# EAGLE design RF24 Node (EAGLE 6.5.0)
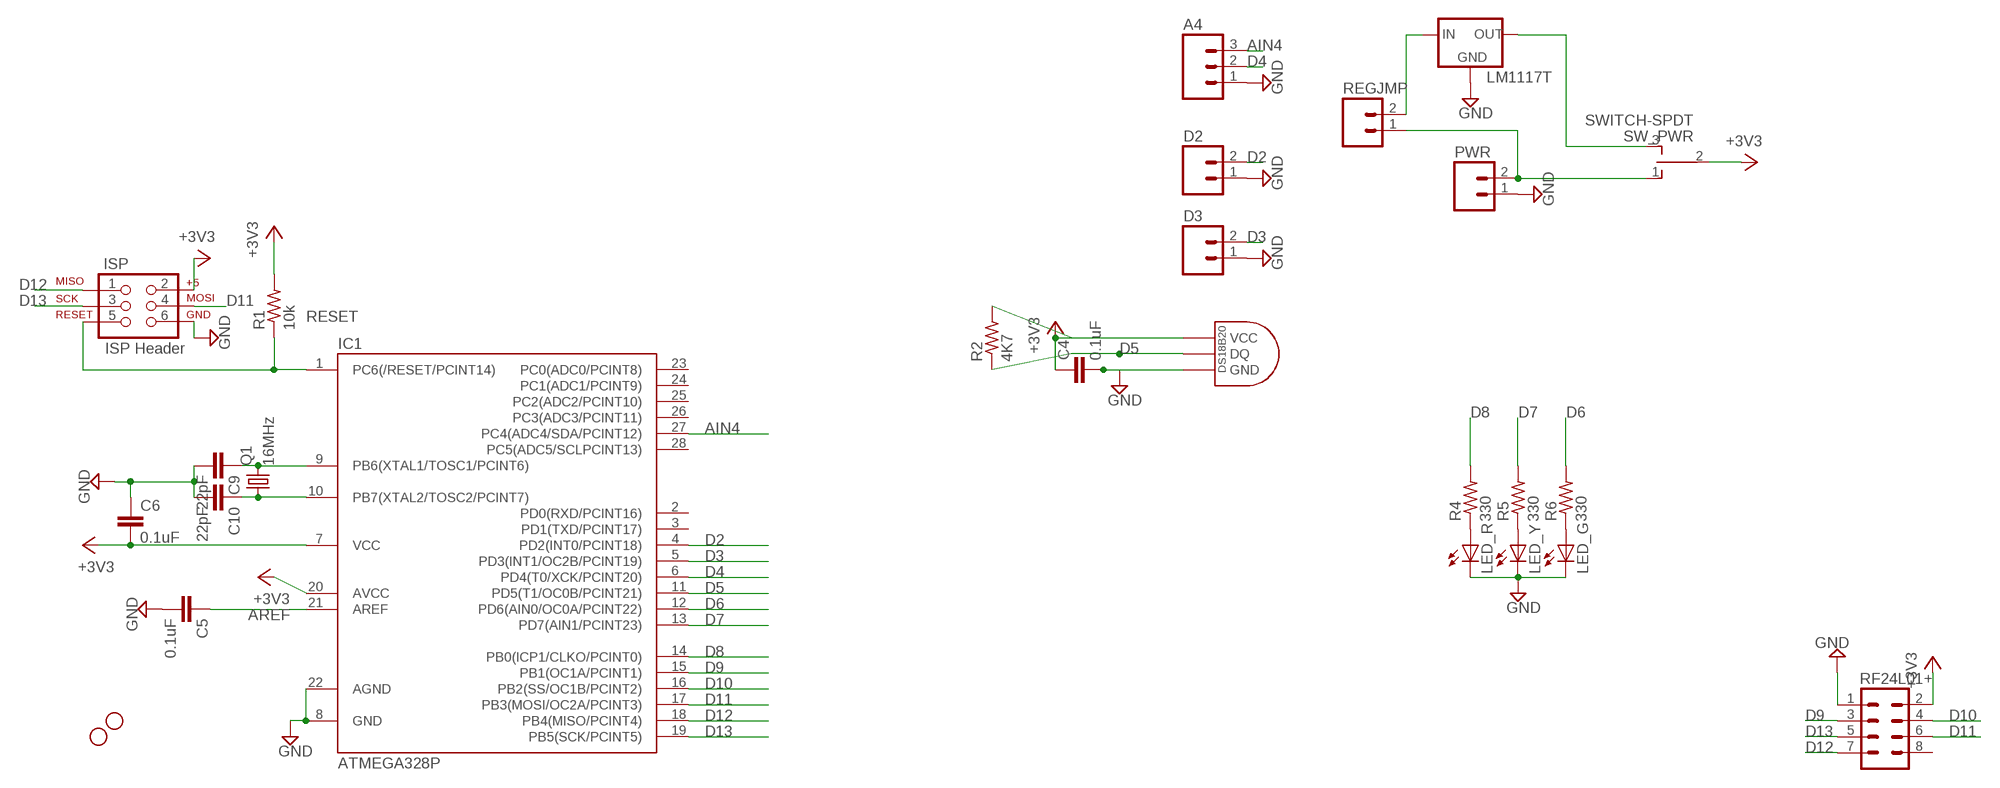
[diagram p0: schematic, sheet 1]

## Parts
A4  M03PTH  [1X03]
C4  0.1uF  C-EU025-025X050  [C025-025X050]
C5  0.1uF  C-EU025-025X050  [C025-025X050]
C6  0.1uF  C-EU025-025X050  [C025-025X050]
C9  22pF  C-EU025-025X050  [C025-025X050]
C10  22pF  C-EU025-025X050  [C025-025X050]
D2  M02PTH  [1X02]
D3  M02PTH  [1X02]
DS18B20  DS1820TO92  [DS1820]
IC1  ATMEGA328P  ATMEGA48/88/168-PU  [DIL28-3]
ISP  ISP Header  AVR_SPI_PRG_6PTH  [2X3]
JP2  STAND-OFF  [STAND-OFF]
JP8  STAND-OFF  [STAND-OFF]
LED_G  LED3MM  [LED3MM]
LED_R  LED3MM  [LED3MM]
LED_Y  LED3MM  [LED3MM]
LM1117T  LM1117T-3.3-V  [TO220V]
PWR  M02PTH  [1X02]
Q1  16MHz  CRYSTALHC49S  [HC49/S]
R1  10k  R-US_0204/2V  [0204V]
R2  4K7  R-US_0204/2V  [0204V]
R4  330  R-US_0204/2V  [0204V]
R5  330  R-US_0204/2V  [0204V]
R6  330  R-US_0204/2V  [0204V]
REGJMP  M02PTH  [1X02]
RF24L01+  M04X2  [2X4]
SW_PWR  SWITCH-SPDT  [OS102011MS2QN1]

## Nets
+3V3: C4.1 C6.2 DS18B20.VDD(VCC) IC1.7(VCC) IC1.20(AVCC) ISP.2 R1.2 R2.2 RF24L01+.2 SW_PWR.2(P)
AIN4: A4.3 IC1.27(PC4(ADC4/SDA/PCINT12))
AREF: C5.1 IC1.21(AREF)
D2: D2.2 IC1.4(PD2(INT0/PCINT18))
D3: D3.2 IC1.5(PD3(INT1/OC2B/PCINT19))
D4: A4.2 IC1.6(PD4(T0/XCK/PCINT20))
D5: DS18B20.DQ IC1.11(PD5(T1/OC0B/PCINT21)) R2.1
D6: IC1.12(PD6(AIN0/OC0A/PCINT22)) R6.2
D7: IC1.13(PD7(AIN1/PCINT23)) R5.2
D8: IC1.14(PB0(ICP1/CLKO/PCINT0)) R4.2
D9: IC1.15(PB1(OC1A/PCINT1)) RF24L01+.3
D10: IC1.16(PB2(SS/OC1B/PCINT2)) RF24L01+.4
D11: IC1.17(PB3(MOSI/OC2A/PCINT3)) ISP.4 RF24L01+.6
D12: IC1.18(PB4(MISO/PCINT4)) ISP.1 RF24L01+.7
D13: IC1.19(PB5(SCK/PCINT5)) ISP.3 RF24L01+.5
EXTPWR: PWR.2 REGJMP.1 SW_PWR.1(O)
GND: A4.1 C4.2 C5.2 C6.1 C9.2 C10.2 D2.1 D3.1 DS18B20.GND IC1.8(GND) IC1.22(AGND) ISP.6 LED_G.K(C) LED_R.K(C) LED_Y.K(C) LM1117T.1(GND) PWR.1 RF24L01+.1
N$1: LM1117T.2(OUT) SW_PWR.3(S)
N$2: LED_R.A R4.1
N$3: LED_Y.A R5.1
N$4: LED_G.A R6.1
N$5: LM1117T.3(IN) REGJMP.2
RESET: IC1.1(PC6(/RESET/PCINT14)) ISP.5 R1.1
XTAL1: C9.1 IC1.9(PB6(XTAL1/TOSC1/PCINT6)) Q1.2
XTAL2: C10.1 IC1.10(PB7(XTAL2/TOSC2/PCINT7)) Q1.1
Unconnected: IC1.2(PD0(RXD/PCINT16)) IC1.3(PD1(TXD/PCINT17)) IC1.23(PC0(ADC0/PCINT8)) IC1.24(PC1(ADC1/PCINT9)) IC1.25(PC2(ADC2/PCINT10)) IC1.26(PC3(ADC3/PCINT11)) IC1.28(PC5(ADC5/SCLPCINT13)) RF24L01+.8

## Library data of the parts
A4 = SparkFun-Connectors:M03: Header 3 Standard 3-pin 0.1" header. Use with straight break away headers (SKU : PRT-00116), right angle break away headers (PRT-00553), swiss pins (PRT-00743), machine pins (PRT-00117), and female headers (PRT-00115). Molex polarized connector foot print use with SKU : PRT-08232 with associated crimp pins and housings.
C4-C6 C9 C10 = resistor:C-EU: CAPACITOR, European symbol
D2 D3 PWR REGJMP = SparkFun-Connectors:M02: Standard 2-pin 0.1" header. Use with - straight break away headers ( PRT-00116) - right angle break away headers (PRT-00553) - swiss pins (PRT-00743) - machine pins (PRT-00117) - female headers (PRT-00115) Molex polarized connector foot print use with: PRT-08233 with associated crimp pins and housings. 2.54_SCREWTERM for use with PRT-10571. 3.5mm Screw Terminal footprints for PRT-08084 5mm Screw Terminal footprints for use with PRT-08433
DS18B20 = Ava:DS1820: DS18B20 Programmable Resolution 1-Wire Digital Thermometer Description The DS18B20 digital thermometer provides 9-bit to 12-bit Celsius temperature measurements and has an alarm function with nonvolatile user-programmable upper and lower trigger points. The DS18B20 communicates over a 1-Wire® bus that by definition requires only one data line (and ground) for communication with a central microprocessor. It has an operating temperature range of -55°C to +125°C and is accurate to ±0.5°C over the range of -10°C to +85°C. In addition, the DS18B20 can derive power directly from the data line ("parasite power"), eliminating the need for an external power supply. Each DS18B20 has a unique 64-bit serial code, which allows multiple DS18B20s to function on the same 1-Wire bus. Thus, it is simple to use one microprocessor to control many DS18B20s distributed over a large area. Applications that can benefit from this feature include HVAC environmental controls, temperature monitoring systems inside buildings, equipment, or machinery, and process monitoring and control systems.
IC1 = atmega8:ATMEGA48/88/168-PU
ISP = SparkFun-Connectors:AVR_SPI_PRG_6: AVR ISP 6 Pin This is the reduced ISP connector for AVR programming. Common on Arduino. This footprint will take up less PCB space and can be used with a 10-pin to 6-pin adapter such as SKU: BOB-08508
JP2 JP8 = SparkFun:STAND-OFF: Stand Off This is the mechanical footprint for a #4 phillips button head screw. Use the keepout ring to avoid running the screw head into surrounding components. SKU : PRT-00447
LED_G LED_R LED_Y = led:LED: LED OSRAM: - CHIPLED LG R971, LG N971, LY N971, LG Q971, LY Q971, LO R971, LY R971 LH N974, LH R974 LS Q976, LO Q976, LY Q976 LO Q996 - Hyper CHIPLED LW Q18S LB Q993, LB Q99A, LB R99A - SideLED LS A670, LO A670, LY A670, LG A670, LP A670 LB A673, LV A673, LT A673, LW A673 LH A674 LY A675 LS A676, LA A676, LO A676, LY A676, LW A676 LS A679, LY A679, LG A679 - Hyper Micro SIDELED® LS Y876, LA Y876, LO Y876, LY Y876 LT Y87S - SmartLED LW L88C, LW L88S LB L89C, LB L89S, LG L890 LS L89K, LO L89K, LY L89K LS L896, LA L896, LO L896, LY L896 - TOPLED LS T670, LO T670, LY T670, LG T670, LP T670 LSG T670, LSP T670, LSY T670, LOP T670, LYG T670 LG T671, LOG T671, LSG T671 LB T673, LV T673, LT T673, LW T673 LH T674 LS T676, LA T676, LO T676, LY T676, LB T676, LH T676, LSB T676, LW T676 LB T67C, LV T67C, LT T67C, LS T67K, LO T67K, LY T67K, LW E67C LS E67B, LA E67B, LO E67B, LY E67B, LB E67C, LV E67C, LT E67C LW T67C LS T679, LY T679, LG T679 LS T770, LO T770, LY T770, LG T770, LP T770 LB T773, LV T773, LT T773, LW T773 LH T774 LS E675, LA E675, LY E675, LS T675 LS T776, LA T776, LO T776, LY T776, LB T776 LHGB T686 LT T68C, LB T68C - Hyper Mini TOPLED® LB M676 - Mini TOPLED Santana® LG M470 LS M47K, LO M47K, LY M47K Source: http://www.osram.convergy.de LUXEON: - LUMILED® LXK2-PW12-R00, LXK2-PW12-S00, LXK2-PW14-U00, LXK2-PW14-V00 LXK2-PM12-R00, LXK2-PM12-S00, LXK2-PM14-U00 LXK2-PE12-Q00, LXK2-PE12-R00, LXK2-PE12-S00, LXK2-PE14-T00, LXK2-PE14-U00 LXK2-PB12-K00, LXK2-PB12-L00, LXK2-PB12-M00, LXK2-PB14-N00, LXK2-PB14-P00, LXK2-PB14-Q00 LXK2-PR12-L00, LXK2-PR12-M00, LXK2-PR14-Q00, LXK2-PR14-R00 LXK2-PD12-Q00, LXK2-PD12-R00, LXK2-PD12-S00 LXK2-PH12-R00, LXK2-PH12-S00 LXK2-PL12-P00, LXK2-PL12-Q00, LXK2-PL12-R00 Source: www.luxeon.com KINGBRIGHT: KA-3528ASYC Source: www.kingbright.com
LM1117T = lm1117:LM1117T-*
Q1 = crystal:CRYSTAL: CRYSTAL; OC_FARNELL: 1667008; OC_NEWARK: unknown
R1 R2 R4-R6 = resistor:R-US_: RESISTOR, American symbol
RF24L01+ = SparkFun:M04X2
SW_PWR = JC:SWITCH-SPDT: TINY SWITCH ON OFF ON Source: http://www2.produktinfo.conrad.com/datenblaetter/700000-724999/705152-da-01-de-Subminiaturschalter_TL_36YO.pdf

## Net classes
0 default: width 0.203 mm, drill 0.33 mm, clearance 0.203 mm

## Board
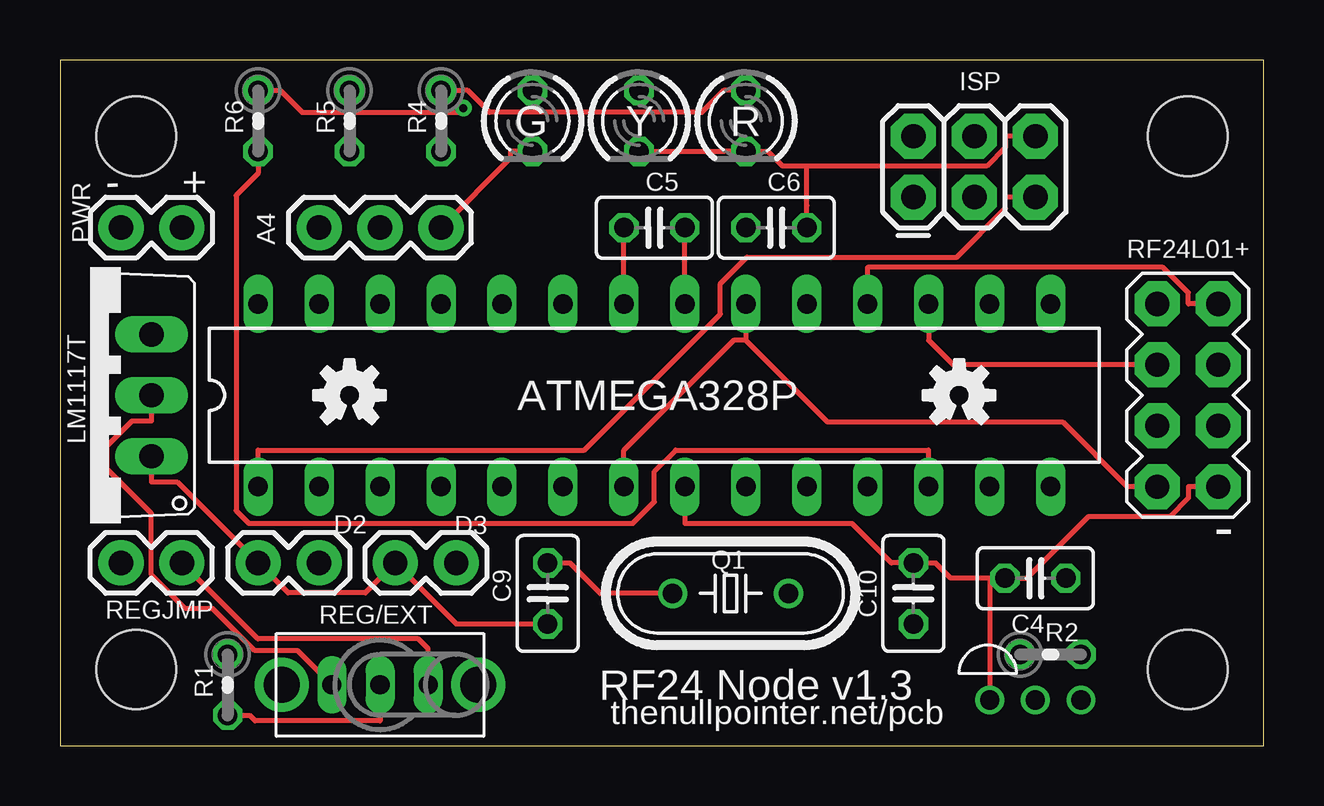
[diagram p1: board, top side]
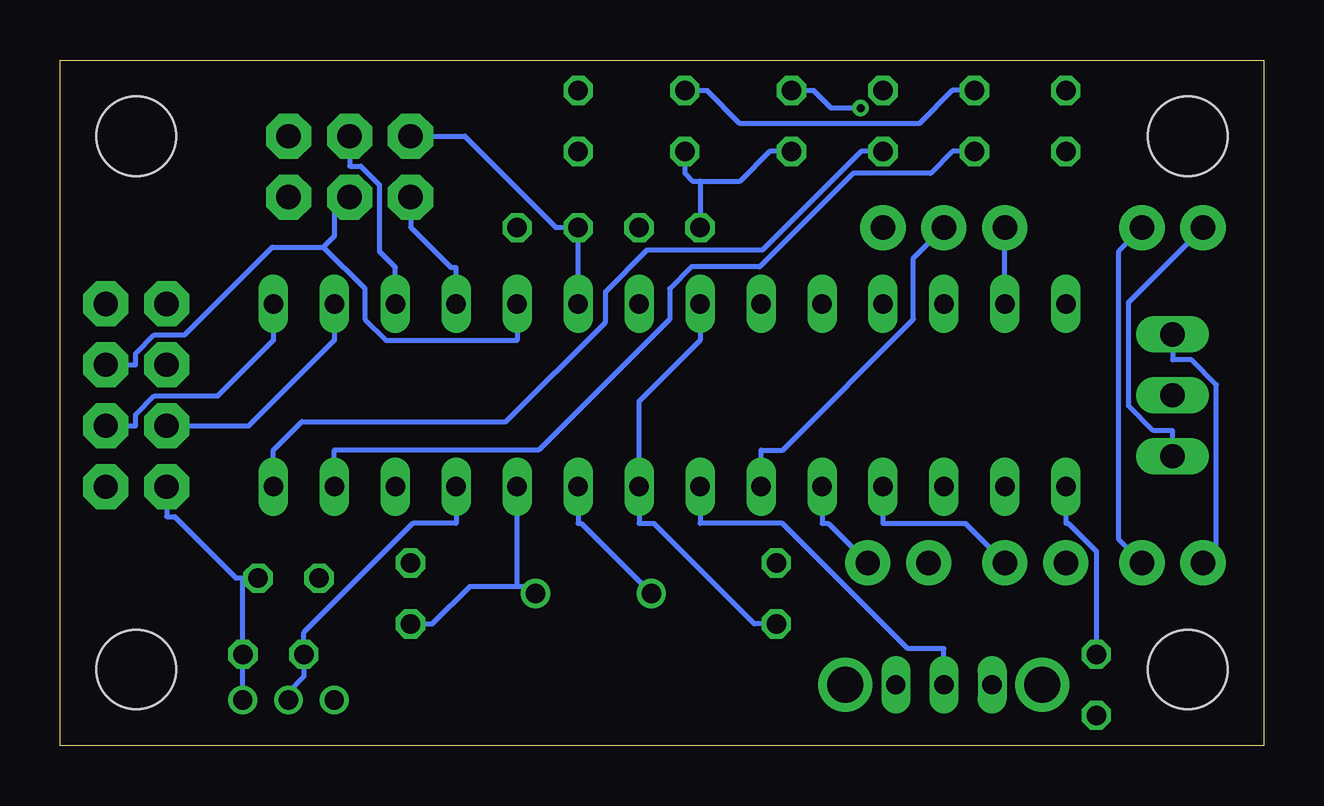
[diagram p2: board, bottom side, seen from below]

Size 50.16 x 28.57 mm. Coordinates in mm from the lower left corner, seen from the top.
Outline: 0,0 50.16,0 50.16,28.57 0,28.57 0,0
Copper layers (1*16): Top 0.0356mm / dielectric 1.5011mm / Bottom 0.0356mm
Design rules "RF24 Node *": minimum track width 6mil, minimum drill 13mil, track to track 6mil, track to pad 6mil, pad to pad 6mil, via to via 6mil, smd to smd 6mil, copper to edge 15mil, drill to drill 6mil, minimum pad ring 7mil, minimum via ring 7mil, stop-mask expansion 3mil, vias tented up to drill 0mil, thermal gap 10mil

### Footprints (pad centres in the part's own frame; a part is rotated, then mirrored left to right if it is on the bottom)
1X03 = drill 1.016 pad 1.88: 1 0,0; 2 2.54,0; 3 5.08,0
C025-025X050 = drill 0.813 octagon: 1 -1.27,0; 2 1.27,0
1X02 = drill 1.016 pad 1.88: 1 0,0; 2 2.54,0
DS1820 = drill 0.8: DQ 2.54,-1.27; GND 0.635,-1.27; VDD 4.445,-1.27
DIL28-3 = drill 0.813 long: 1 -16.51,-3.81; 2 -13.97,-3.81; 3 -11.43,-3.81; 4 -8.89,-3.81; 5 -6.35,-3.81; 6 -3.81,-3.81; 7 -1.27,-3.81; 8 1.27,-3.81; 9 3.81,-3.81; 10 6.35,-3.81; 11 8.89,-3.81; 12 11.43,-3.81; 13 13.97,-3.81; 14 16.51,-3.81; 15 16.51,3.81; 16 13.97,3.81; 17 11.43,3.81; 18 8.89,3.81; 19 6.35,3.81; 20 3.81,3.81; 21 1.27,3.81; 22 -1.27,3.81; 23 -3.81,3.81; 24 -6.35,3.81; 25 -8.89,3.81; 26 -11.43,3.81; 27 -13.97,3.81; 28 -16.51,3.81
2X3 = drill 1.016 pad 1.88 octagon: 1 0,0; 2 0,2.54; 3 2.54,0; 4 2.54,2.54; 5 5.08,0; 6 5.08,2.54
STAND-OFF = hole 3.302: 0,0
LED3MM = drill 0.813 octagon: A -1.27,0; K 1.27,0
TO220V = drill 1.016 long: 1 -2.54,-2.54; 2 0,-2.54; 3 2.54,-2.54
HC49/S = drill 0.813: 1 -2.413,0; 2 2.413,0
0204V = drill 0.813 octagon: 1 -1.27,0; 2 1.27,0
2X4 = drill 1.016 pad 1.88 octagon: 1 -3.81,-1.27; 2 -3.81,1.27; 3 -1.27,-1.27; 4 -1.27,1.27; 5 1.27,-1.27; 6 1.27,1.27; 7 3.81,-1.27; 8 3.81,1.27
OS102011MS2QN1 = drill 0.8 pad 1.016 long: 1 -2.007,0; 2 0,0; 3 2.007,0 | drill 1.5 pad 1.778: M1 -4.102,0; M2 4.102,0

### Placement (x,y rotation side)
A4  15.88,21.59 180 top
C4  40.64,6.99 180 top
C5  24.77,21.59 180 top
C6  29.84,21.59 180 top
C9  20.32,6.35 270 top
C10  35.56,6.35 90 top
D2  8.26,7.62 0 top
D3  13.97,7.62 0 top
DS18B20  38.1,3.17 0 top
IC1  24.77,14.61 0 top
ISP  35.56,22.86 0 top
JP1  STAND-OFF  [STAND-OFF]  46.99,25.4 0 top
JP2  3.17,3.17 0 top
JP8  3.17,25.4 0 top
JP9  STAND-OFF  [STAND-OFF]  46.99,3.17 90 top
LED_G  19.68,26.04 270 top
LED_R  28.57,26.04 270 top
LED_Y  24.13,26.04 270 top
LM1117T  1.27,14.61 90 top
PWR  2.54,21.59 0 top
Q1  27.94,6.35 180 top
R1  6.99,2.54 270 top
R2  41.27,3.81 0 top
R4  15.88,26.04 270 top
R5  12.06,26.04 270 top
R6  8.26,26.04 270 top
REGJMP  5.08,7.62 180 top
RF24L01+  46.99,14.61 90 top
SW_PWR  13.34,2.54 180 top
U$1  [OSHW-LOGO-S]  37.47,14.61 0 top
U$2  [OSHW-LOGO-S]  12.06,14.61 0 top

### Tracks (layer width: path | path; a pad name or v marks a point on that pad's centre or on a via)
+3V3
  Top 0.203: 28.57,16.89 28.07,16.89 23.5,12.32 IC1.7 | R1.2 7.9,1.27 8.13,1.03 13.34,1.03 SW_PWR.2 | 28.57,16.89 31.97,13.49 41.78,13.49 44.48,10.79 RF24L01+.2 | IC1.20 28.57,16.89
  Bottom 0.203: IC1.7 23.5,9.27 20.07,9.27 14.84,4.04 13.34,4.04 SW_PWR.2 | 42.55,6.99 R2.2 DS18B20.VDD | 42.55,6.99 42.82,6.99 45.39,9.55 45.72,9.55 RF24L01+.2 | C4.1 42.55,6.99 | IC1.20 C6.2 29.49,21.59 33.3,25.4 ISP.2
AIN4
  Bottom 0.203: IC1.27 A4.3
AREF
  Top 0.203: IC1.21 C5.1
D2
  Bottom 0.203: IC1.4 15.88,9.27 12.45,9.27 D2.2
D3
  Bottom 0.203: IC1.5 18.41,9.27 18.16,9.27 D3.2
D4
  Bottom 0.203: IC1.6 20.95,12.32 20.06,12.32 14.61,17.77 14.61,20.32 A4.2
D5
  Bottom 0.203: IC1.11 33.66,9.27 35.46,9.27 40.01,4.72 R2.1 40.01,2.9 40.64,2.26 DS18B20.DQ
D6
  Top 0.203: IC1.12 36.2,12.32 25.65,12.32 24.77,11.43 24.77,10.16 23.88,9.27 7.87,9.27 7.34,9.8 7.34,22.93 8.26,23.85 R6.2
D7
  Bottom 0.203: IC1.13 38.73,12.32 30.22,12.32 24.77,17.77 24.77,19.05 23.86,19.95 21.01,19.95 17.11,23.85 13.89,23.85 12.98,24.77 R5.2
D8
  Bottom 0.203: R4.2 16.79,24.77 20.89,20.66 25.7,20.66 27.43,18.93 27.43,17.66 31.58,13.5 40.09,13.5 41.27,12.32 IC1.14
D9
  Bottom 0.203: IC1.15 41.27,16.89 43.59,14.58 46.24,14.58 47.02,13.8 47.02,13.34 RF24L01+.3
D10
  Bottom 0.203: IC1.16 38.73,16.89 42.29,13.34 RF24L01+.4
D11
  Top 0.203: IC1.17 36.2,16.89 37.21,15.88 RF24L01+.6
  Bottom 0.203: IC1.17 36.2,19.94 36.85,20.6 36.85,23.38 37.63,24.16 38.1,24.16 ISP.4
D12
  Top 0.203: IC1.18 33.66,19.94 45.96,19.94 47.02,18.88 47.02,18.41 RF24L01+.7
  Bottom 0.203: IC1.18 33.66,19.94 33.88,19.94 35.56,21.61 ISP.1
D13
  Bottom 0.203: RF24L01+.5 47.02,15.88 47.02,16.34 46.24,17.12 44.98,17.12 41.32,20.78 39.19,20.78 | 39.19,20.78 38.72,21.24 38.72,22.86 ISP.3 | 39.19,20.78 37.47,19.05 37.47,17.78 36.58,16.89 31.11,16.89 IC1.19
EXTPWR
  Top 0.203: REGJMP.1 8.25,4.45 14.94,4.45 15.34,4.04 SW_PWR.1
  Bottom 0.203: REGJMP.1 6.05,8.59 6.05,20.62 PWR.2
GND
  Top 0.203: RF24L01+.1 47.02,10.79 47.02,10.33 46.24,9.55 42.85,9.55 40.28,6.99 C4.2 39.13,6.99 38.73,6.99 | LM1117T.1 3.81,11 4.88,11 D2.1 9.5,6.37 12.72,6.37 D3.1 16.51,5.08 C9.2 | 38.73,6.99 37.11,6.99 36.47,7.62 C10.2 34.65,7.62 32.99,9.27 26.04,9.27 IC1.8 | 38.73,6.99 DS18B20.GND | LED_G.K 18.77,24.77 18.77,24.49 A4.1 | LED_Y.K 27.66,24.77 LED_R.K 29.49,24.77 30.11,24.15 31.11,24.15 | IC1.22 C5.2 | 31.11,24.15 38.61,24.15 39.4,24.93 39.4,25.4 ISP.6 | 31.11,24.15 31.11,22.5 C6.1
  Bottom 0.203: LM1117T.1 3.81,13.13 4.61,13.13 5.64,14.16 5.64,18.49 PWR.1 | C9.2 21.23,5.08 25.43,9.27 26.04,9.27 IC1.8 26.04,11.16 26.04,12.32 26.04,14.35 23.5,16.89 IC1.22 | 23.5,23.53 21.83,23.53 20.6,24.77 LED_G.K | 23.5,23.53 23.81,23.53 24.13,23.85 LED_Y.K | 23.5,23.53 C5.2
N$1
  Top 0.203: LM1117T.2 3.81,13.54 3.01,13.54 1.98,12.51 1.98,11.52 3.81,9.69 3.81,7.13 5.22,5.71 6.37,5.71 8.12,3.97 9.9,3.97 SW_PWR.3
N$2
  Top 0.203: LED_R.A 27.66,27.3 26.75,26.39 17.9,26.39 16.99,27.3 16.79,27.3 R4.1
N$3
  Bottom 0.203: LED_Y.A 23.22,27.3 21.84,25.92 14.36,25.92 12.98,27.3 R5.1
N$4  (via drill 0.33 pad 0.69)
  Top 0.203: R6.1 9.17,27.3 10.08,26.39 16.62,26.39 v16.8,26.57
  Bottom 0.203: LED_G.A 18.77,27.3 18.04,26.57 v16.8,26.57
N$5
  Bottom 0.203: LM1117T.3 3.81,16.08 3.01,16.08 1.98,15.05 1.98,8.18 REGJMP.2
RESET
  Top 0.203: ISP.5 39.4,22.86 39.4,22.39 37.37,20.37 28.62,20.37 27.52,19.26 27.52,17.99 21.85,12.32 8.26,12.32 IC1.1
  Bottom 0.203: IC1.1 8.26,9.27 8.14,9.27 6.99,8.11 R1.1
XTAL1
  Top 0.203: C9.1 21.23,7.62 22.5,6.35 Q1.2
  Bottom 0.203: IC1.9 28.57,9.27 28.45,9.27 Q1.2
XTAL2
  Bottom 0.203: 31.11,6.63 33.1,6.63 34.65,5.08 C10.1 | Q1.1 30.63,6.63 31.11,6.63 | 31.11,6.63 IC1.10

### Text on the board
tPlace: G | Y | R | -
tNames: - | + | PWR | REG/EXT | RF24 Node v1.3 | thenullpointer.net/pcb